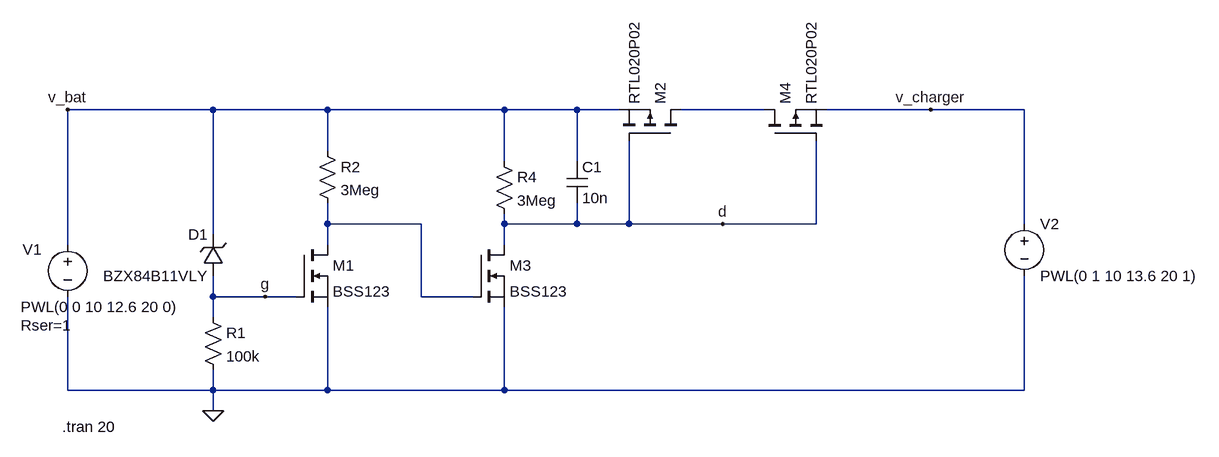
[diagram p0: schematic OV shutdown.asc]
OV shutdown.asc, the LTspice schematic file:
Version 4
SHEET 1 1696 680
WIRE 160 -80 -64 -80
WIRE 336 -80 160 -80
WIRE 608 -80 336 -80
WIRE 720 -80 608 -80
WIRE 784 -80 720 -80
WIRE 1008 -80 880 -80
WIRE 1264 -80 1104 -80
WIRE 1408 -80 1264 -80
WIRE 336 -16 336 -80
WIRE 608 0 608 -80
WIRE 720 0 720 -80
WIRE 336 96 336 64
WIRE 480 96 336 96
WIRE 608 96 608 80
WIRE 720 96 720 64
WIRE 720 96 608 96
WIRE 800 96 800 -32
WIRE 800 96 720 96
WIRE 944 96 800 96
WIRE 1088 96 1088 -32
WIRE 1088 96 944 96
WIRE 1408 96 1408 -80
WIRE 160 112 160 -80
WIRE -64 128 -64 -80
WIRE 336 128 336 96
WIRE 608 128 608 96
WIRE 160 208 160 176
WIRE 240 208 160 208
WIRE 288 208 240 208
WIRE 480 208 480 96
WIRE 560 208 480 208
WIRE 160 240 160 208
WIRE -64 352 -64 208
WIRE 160 352 160 320
WIRE 160 352 -64 352
WIRE 336 352 336 224
WIRE 336 352 160 352
WIRE 608 352 608 224
WIRE 608 352 336 352
WIRE 1408 352 1408 176
WIRE 1408 352 608 352
WIRE 160 384 160 352
FLAG 160 384 0
FLAG 1264 -80 v_charger
FLAG -64 -80 v_bat
FLAG 240 208 g
FLAG 944 96 d
SYMBOL zener 176 176 R180
WINDOW 0 24 64 Left 2
WINDOW 3 24 0 Left 2
SYMATTR InstName D1
SYMATTR Value BZX84B11VLY
SYMATTR Description Diode
SYMATTR Type diode
SYMBOL res 144 224 R0
SYMATTR InstName R1
SYMATTR Value 100k
SYMBOL nmos 288 128 R0
SYMATTR InstName M1
SYMATTR Value BSS123
SYMBOL pmos 880 -32 M270
SYMATTR InstName M2
SYMATTR Value RTL020P02
SYMBOL res 320 -32 R0
SYMATTR InstName R2
SYMATTR Value 3Meg
SYMBOL voltage -64 112 R0
WINDOW 0 -69 23 Left 2
WINDOW 3 -72 112 Left 2
WINDOW 123 -236 162 Left 2
WINDOW 39 -72 140 Left 2
SYMATTR InstName V1
SYMATTR Value PWL(0 0 10 12.6 20 0)
SYMATTR SpiceLine Rser=1
SYMBOL nmos 560 128 R0
SYMATTR InstName M3
SYMATTR Value BSS123
SYMBOL res 592 -16 R0
SYMATTR InstName R4
SYMATTR Value 3Meg
SYMBOL pmos 1008 -32 R270
SYMATTR InstName M4
SYMATTR Value RTL020P02
SYMBOL voltage 1408 80 R0
WINDOW 123 0 0 Left 0
WINDOW 39 24 124 Left 2
SYMATTR InstName V2
SYMATTR Value PWL(0 1 10 13.6 20 1)
SYMBOL cap 704 0 R0
SYMATTR InstName C1
SYMATTR Value 10n
TEXT -72 408 Left 2 !.tran 20

The netlist it stands for:
* OV shutdown.asc
D1 g v_bat BZX84B11VLY
R1 g 0 100k
M1 N002 g 0 0 BSS123
M2 N001 d v_bat v_bat RTL020P02
R2 v_bat N002 3Meg
V1 v_bat 0 PWL(0 0 10 12.6 20 0) Rser=1
M3 d N002 0 0 BSS123
R4 v_bat d 3Meg
M4 N001 d v_charger v_charger RTL020P02
V2 v_charger 0 PWL(0 1 10 13.6 20 1)
C1 v_bat d 10n
.model D D
.lib standard.dio
.model NMOS NMOS
.model PMOS PMOS
.lib standard.mos
.tran 20
.backanno
.end